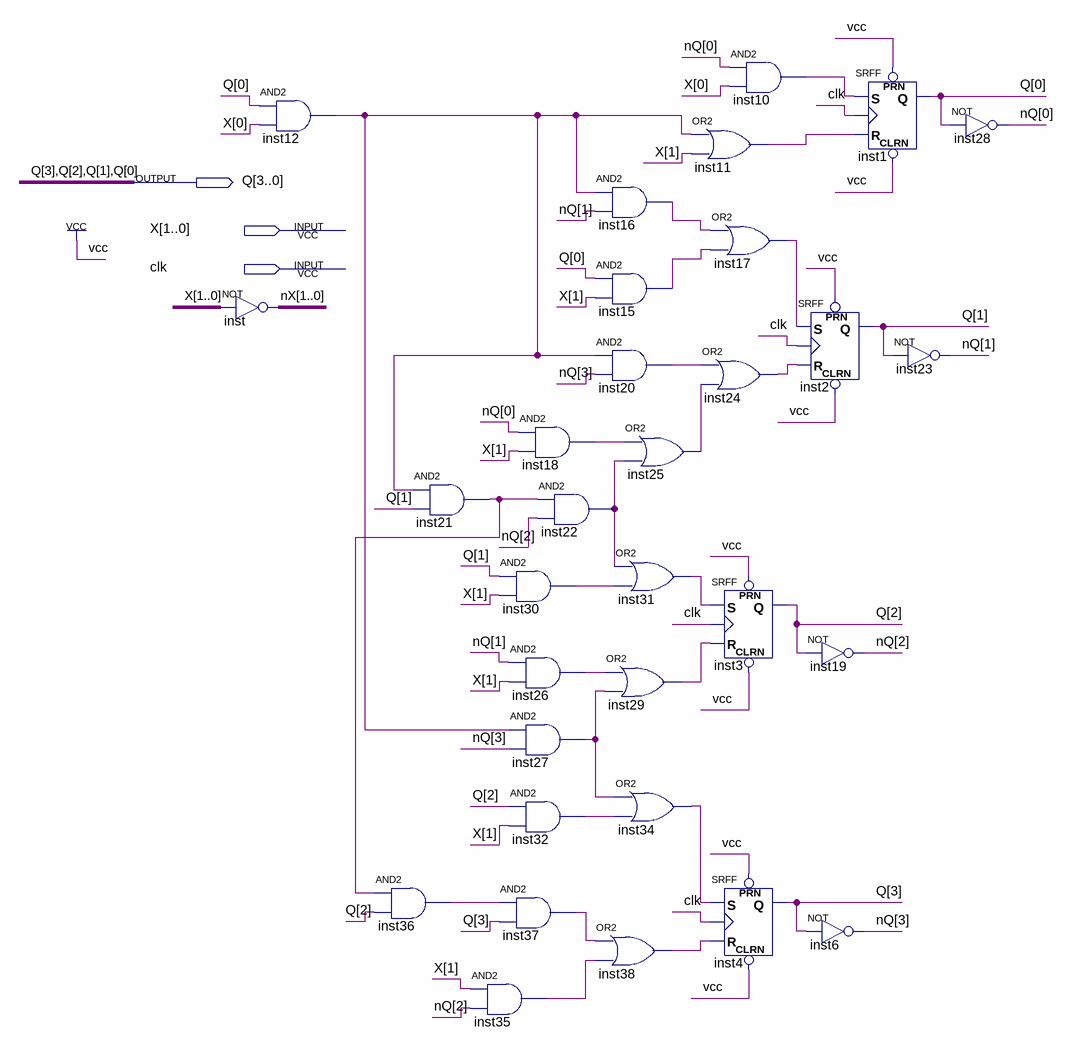
[diagram p0: schematic sheet]
// Quartus schematic SRT.bdf as structural Verilog: 32 symbols, 3 pins
module SRT (
  input  [1:0] X,
  input  clk,
  output [3:0] Q
);

  wire inst10_out, inst11_out, inst12_out, inst15_out, inst16_out, inst17_out, inst18_out, inst20_out,
       inst21_out, inst22_out, inst24_out, inst25_out, inst26_out, inst27_out, inst29_out, inst30_out,
       inst31_out, inst32_out, inst34_out, inst35_out, inst36_out, inst37_out, inst38_out;
  wire [1:0] nX;
  wire [3:0] nQ;

  and inst12 (inst12_out, Q[0], X[0]);
  assign nX = ~X;  // NOT inst, 2 bits wide
  and inst21 (inst21_out, inst12_out, Q[1]);
  and inst36 (inst36_out, inst21_out, Q[2]);
  and inst35 (inst35_out, X[1], nQ[2]);
  and inst18 (inst18_out, nQ[0], X[1]);
  and inst22 (inst22_out, inst21_out, nQ[2]);
  and inst30 (inst30_out, Q[1], X[1]);
  and inst26 (inst26_out, nQ[1], X[1]);
  and inst27 (inst27_out, inst12_out, nQ[3]);
  and inst32 (inst32_out, Q[2], X[1]);
  and inst37 (inst37_out, inst36_out, Q[3]);
  and inst16 (inst16_out, inst12_out, nQ[1]);
  and inst15 (inst15_out, Q[0], X[1]);
  and inst20 (inst20_out, inst12_out, nQ[3]);
  or inst25 (inst25_out, inst18_out, inst22_out);
  or inst31 (inst31_out, inst22_out, inst30_out);
  or inst29 (inst29_out, inst26_out, inst27_out);
  or inst34 (inst34_out, inst27_out, inst32_out);
  or inst38 (inst38_out, inst37_out, inst35_out);
  or inst11 (inst11_out, inst12_out, X[1]);
  or inst17 (inst17_out, inst16_out, inst15_out);
  or inst24 (inst24_out, inst20_out, inst25_out);
  SRFF inst3 (.PRN(1'b1), .CLRN(1'b1), .S(inst31_out), .R(inst29_out), .CLK(clk), .Q(Q[2]));
  SRFF inst4 (.PRN(1'b1), .CLRN(1'b1), .S(inst34_out), .R(inst38_out), .CLK(clk), .Q(Q[3]));
  and inst10 (inst10_out, nQ[0], X[0]);
  SRFF inst2 (.PRN(1'b1), .CLRN(1'b1), .S(inst17_out), .R(inst24_out), .CLK(clk), .Q(Q[1]));
  SRFF inst1 (.PRN(1'b1), .CLRN(1'b1), .S(inst10_out), .R(inst11_out), .CLK(clk), .Q(Q[0]));
  not inst19 (nQ[2], Q[2]);
  not inst6 (nQ[3], Q[3]);
  not inst28 (nQ[0], Q[0]);
  not inst23 (nQ[1], Q[1]);
endmodule
